# EAGLE schematic n64adv2 (EAGLE 9.1.3)

## Sheet 1 of 3
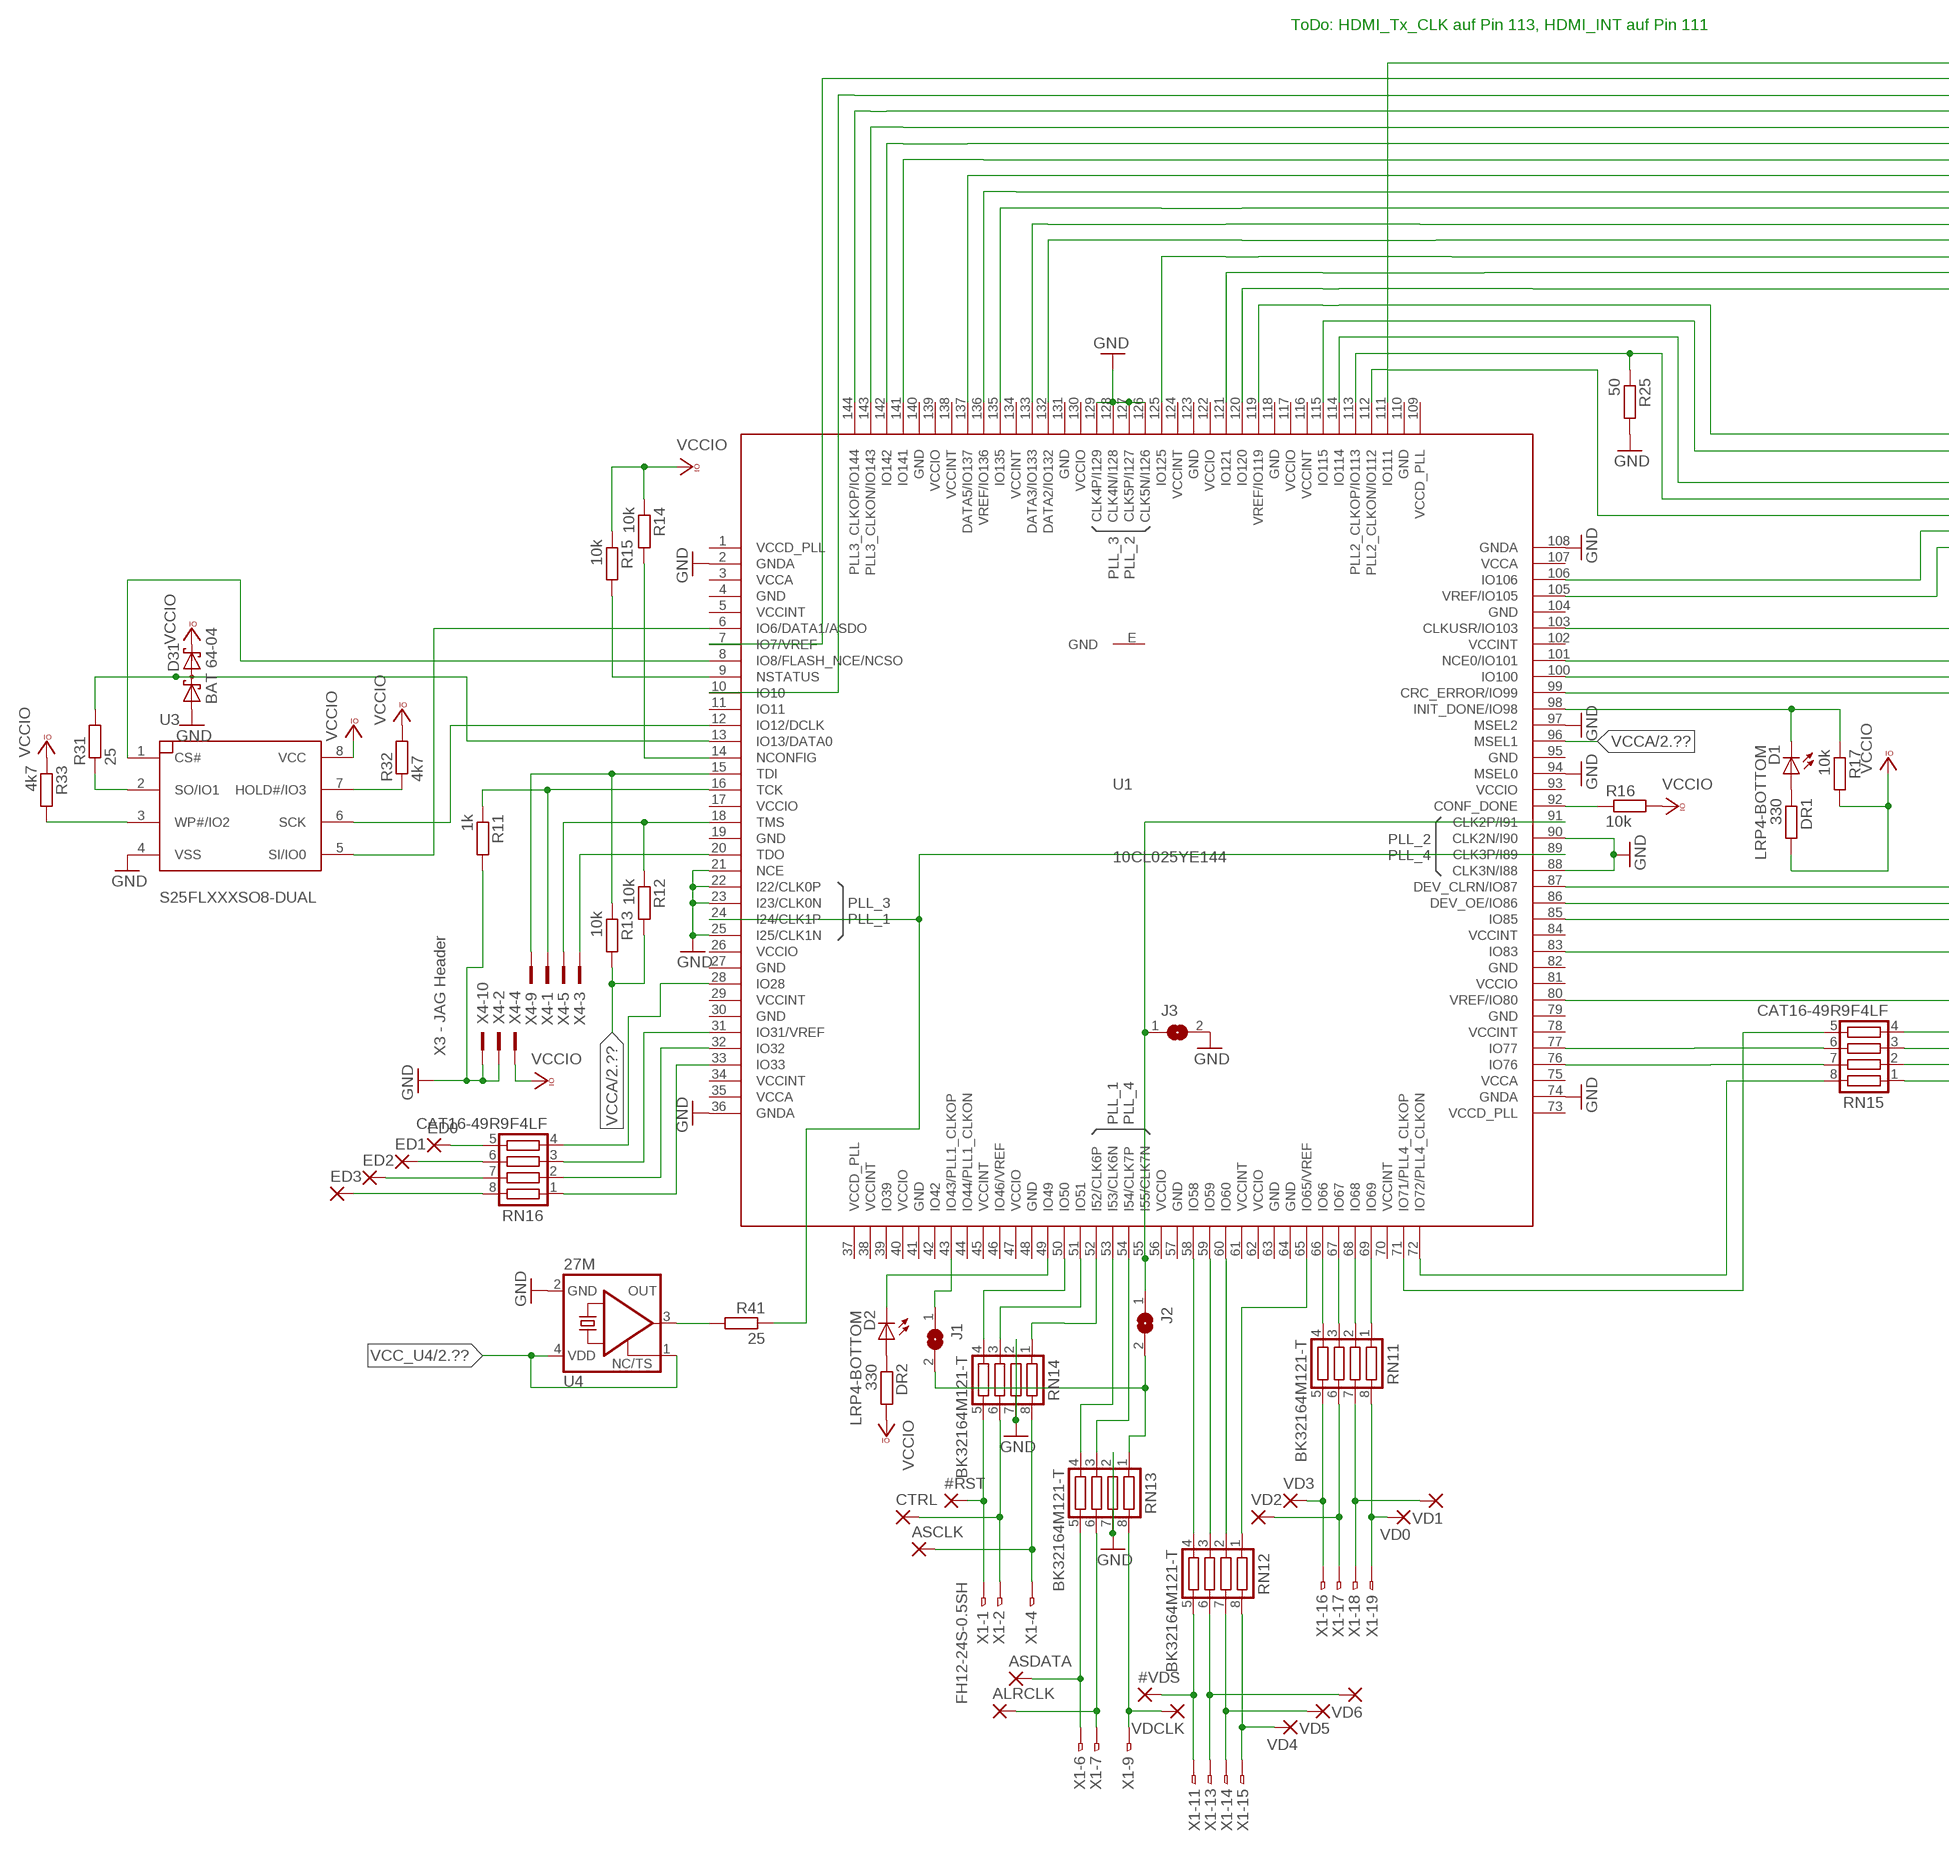
[diagram p0: schematic, sheet 1, part 1 of 2]
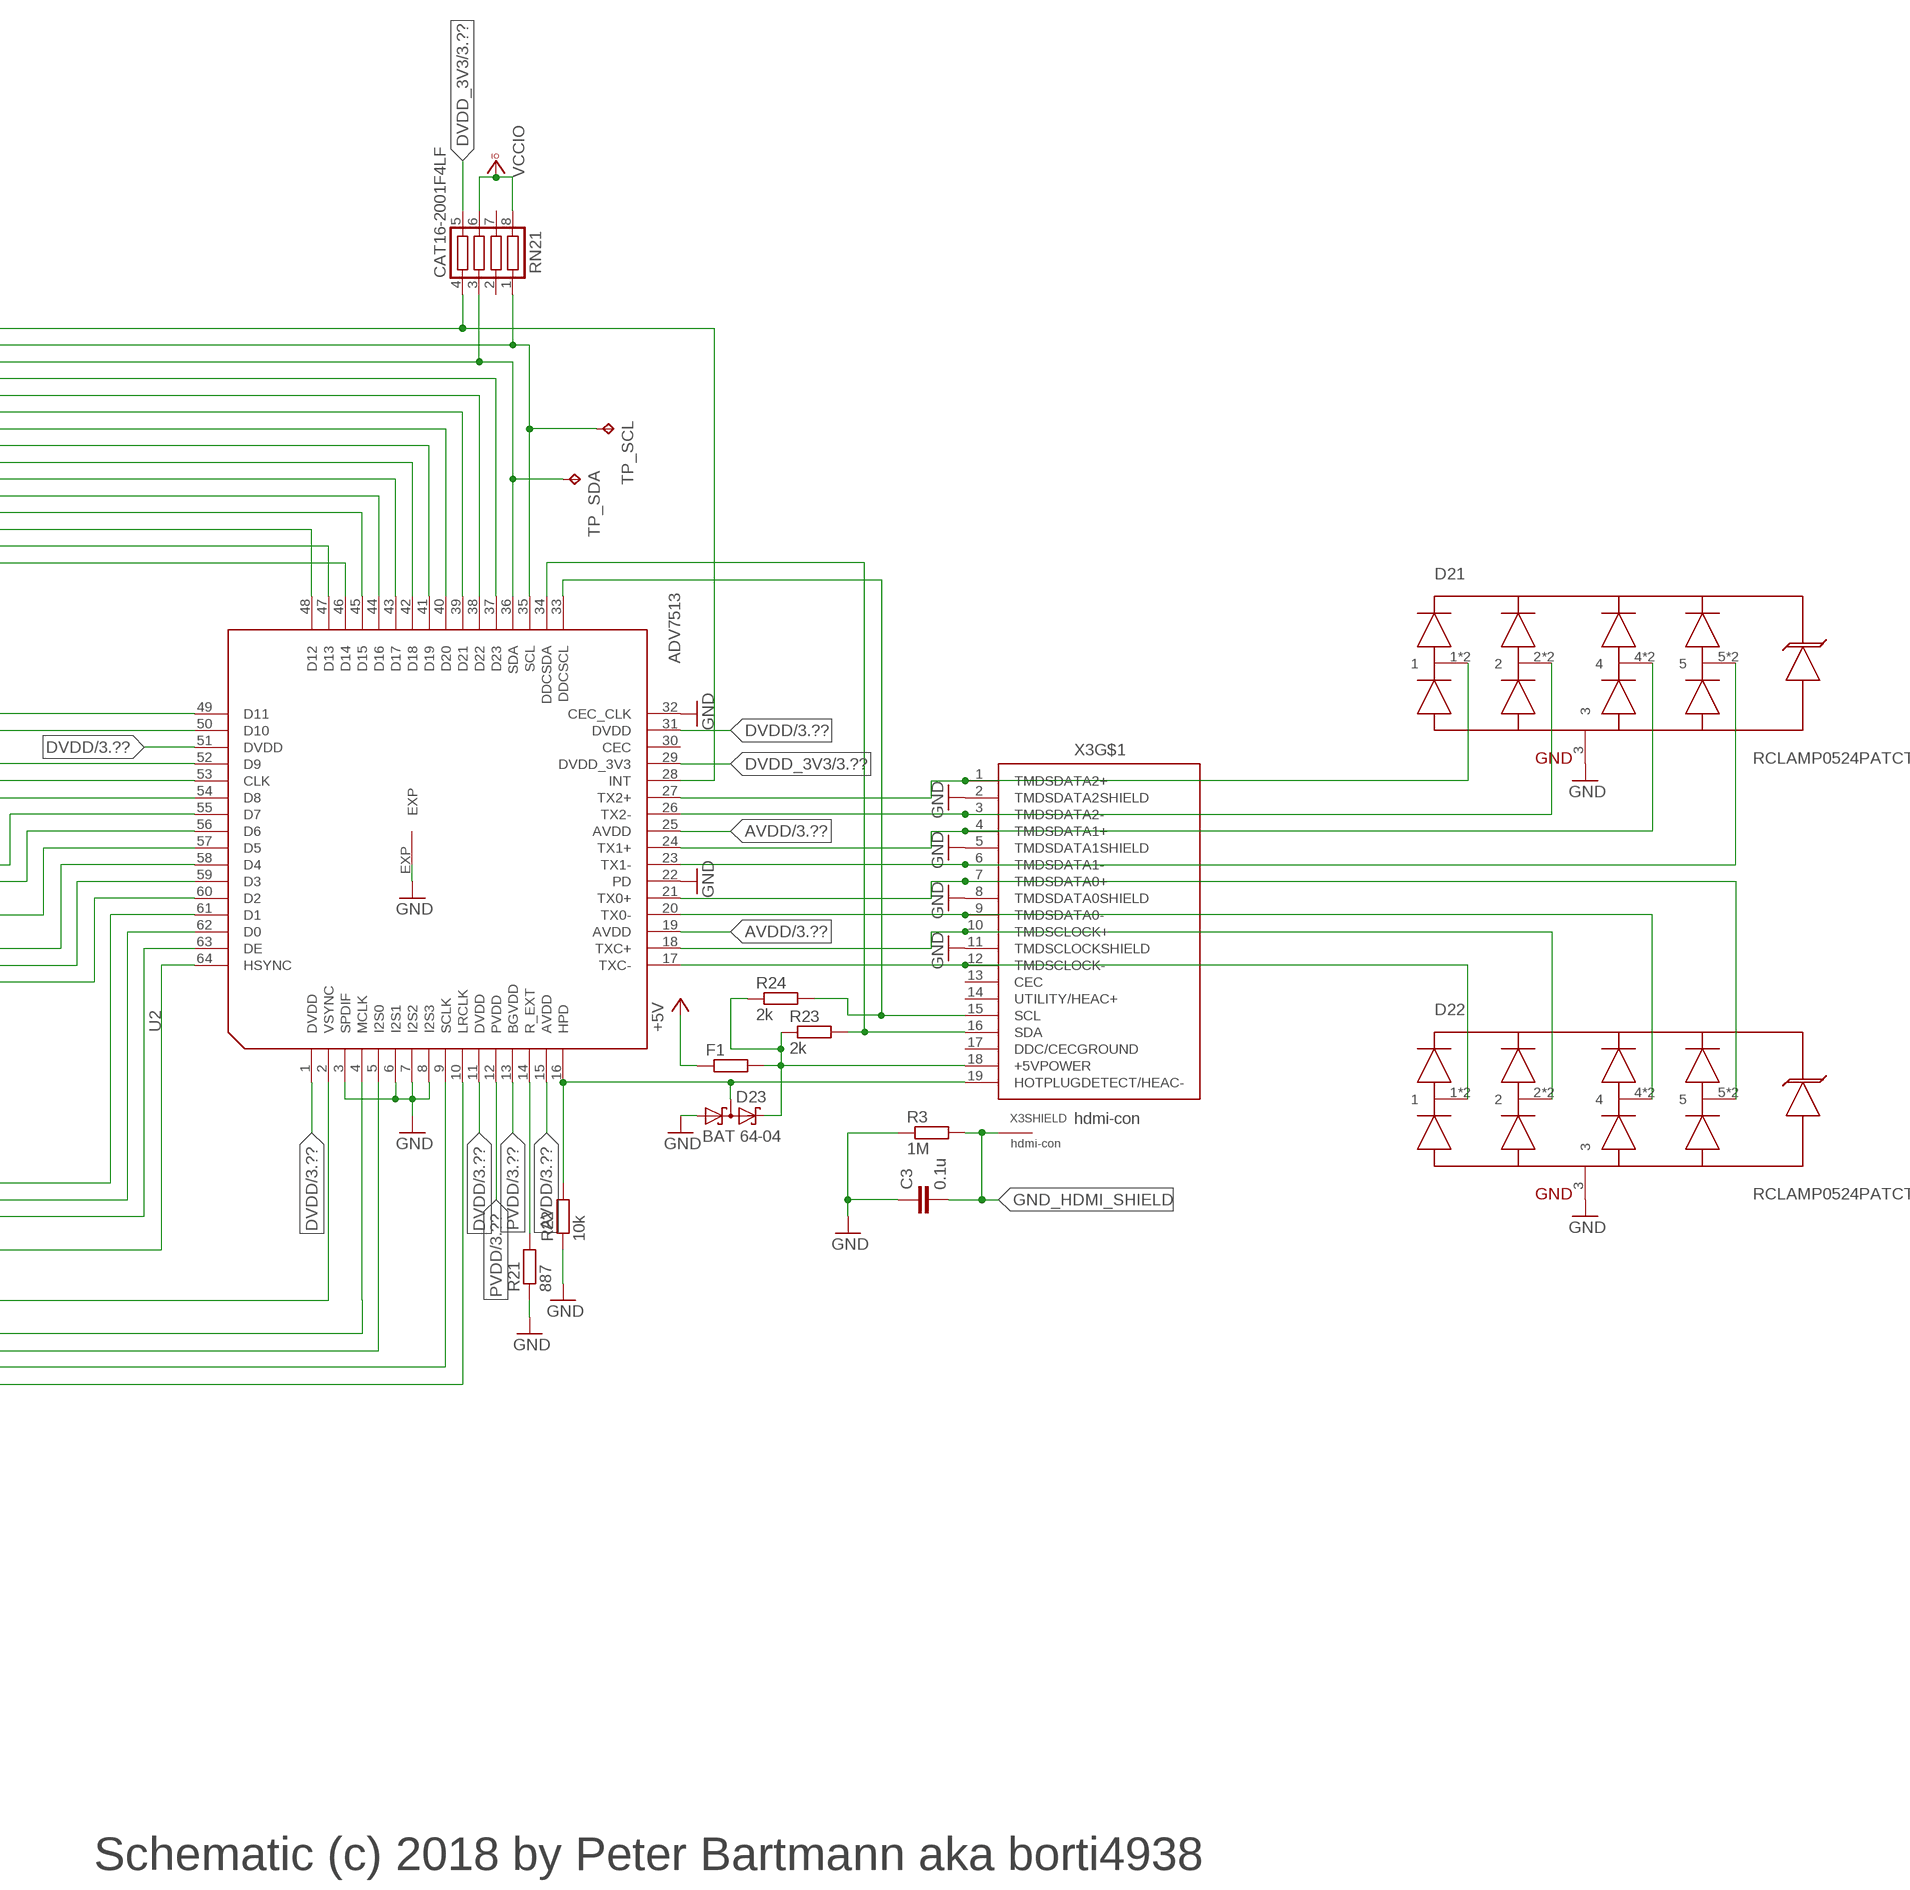
[diagram p1: schematic, sheet 1, part 2 of 2]

### Parts
#RST  SMD1  [SMD0,8-1,6]
#VDS  SMD1  [SMD0,8-1,6]
ALRCLK  SMD1  [SMD0,8-1,6]
ASCLK  SMD1  [SMD0,8-1,6]
ASDATA  SMD1  [SMD0,8-1,6]
C3  0.1u  C-EUC0603  [C0603]
CTRL  SMD1  [SMD0,8-1,6]
D1  LRP4-BOTTOM  [P47F-BOTTOM]
D2  LRP4-BOTTOM  [P47F-BOTTOM]
D21  RCLAMP0524PATCT  HDMI_RCLAMP  [HDMI_RCLAMP]
D22  RCLAMP0524PATCT  HDMI_RCLAMP  [HDMI_RCLAMP]
D23  BAT 64-04  BAT54S  [SOT23]
D31  BAT 64-04  BAT54S  [SOT23]
DR1  330  R-EU_R0603  [R0603]
DR2  330  R-EU_R0603  [R0603]
ED0  SMD1  [SMD0,8-1,6]
ED1  SMD1  [SMD0,8-1,6]
ED2  SMD1  [SMD0,8-1,6]
ED3  SMD1  [SMD0,8-1,6]
F1  R-EU_R0603  [R0603]
J1  SJSMALL  [SJ_SMALL]
J2  SJSMALL  [SJ_SMALL]
J3  SJSMALL  [SJ_SMALL]
R3  1M  R-EU_R0603  [R0603]
R11  1k  R-EU_R0603  [R0603]
R12  10k  R-EU_R0603  [R0603]
R13  10k  R-EU_R0603  [R0603]
R14  10k  R-EU_R0603  [R0603]
R15  10k  R-EU_R0603  [R0603]
R16  10k  R-EU_R0603  [R0603]
R17  10k  R-EU_R0603  [R0603]
R21  887  R-EU_R0603  [R0603]
R22  10k  R-EU_R0603  [R0603]
R23  2k  R-EU_R0603  [R0603]
R24  2k  R-EU_R0603  [R0603]
R25  50  R-EU_R0603  [R0603]
R31  25  R-EU_R0603  [R0603]
R32  4k7  R-EU_R0603  [R0603]
R33  4k7  R-EU_R0603  [R0603]
R41  25  R-EU_R0603  [R0603]
RN11  BK32164M121-T  CTS742C083  [CTS742C083]
RN12  BK32164M121-T  CTS742C083  [CTS742C083]
RN13  BK32164M121-T  CTS742C083  [CTS742C083]
RN14  BK32164M121-T  CTS742C083  [CTS742C083]
RN15  CAT16-49R9F4LF  CTS742C083  [CTS742C083]
RN16  CAT16-49R9F4LF  CTS742C083  [CTS742C083]
RN21  CAT16-2001F4LF  CTS742C083  [CTS742C083]
TP_SCL  TPB1,27  [B1,27]
TP_SDA  TPB1,27  [B1,27]
U1  10CL025YE144  [EQFP144_2]
U2  ADV7513  [LQFP64_EP]
U3  S25FLXXXSO8-DUAL  [SO8-DUAL]
U4  27M  KXO-PXO/XO-V96  [3.2X2.5_KXO-V96]
VD0  SMD1  [SMD0,8-1,6]
VD1  SMD1  [SMD0,8-1,6]
VD2  SMD1  [SMD0,8-1,6]
VD3  SMD1  [SMD0,8-1,6]
VD4  SMD1  [SMD0,8-1,6]
VD5  SMD1  [SMD0,8-1,6]
VD6  SMD1  [SMD0,8-1,6]
VDCLK  SMD1  [SMD0,8-1,6]
X1  FH12-24S-0.5SH  [FH12-24S-0.5SH]
X3  hdmi-con  685119134923  [685119134923]
X4  2510-  [PAK100/2500-10]

### Nets
+5V: F1.1 ; also sheet 3
AVDD: U2.15(AVDD) U2.19(AVDD) U2.25(AVDD) ; also sheet 3
DVDD: U2.1(DVDD) U2.11(DVDD) U2.31(DVDD) U2.51(DVDD) ; also sheet 3
DVDD_3V3: RN21.5 U2.29(DVDD_3V3) ; also sheet 3
GND: C3.1 D21.3 D22.3 D23.1(A1) D31.1(A1) J3.2 R3.1 R11.2 R21.1 R22.1 R25.2 RN13.2 RN13.7 RN14.2 RN14.7 U1.2(GNDA) U1.21(NCE) U1.22(I22/CLK0P) U1.23(I23/CLK0N) U1.25(I25/CLK1N) U1.36(GNDA) U1.74(GNDA) U1.88(CLK3N/I88) U1.90(CLK2N/I90) U1.94(MSEL0) U1.97(MSEL2) U1.108(GNDA) U1.126(CLK5N/I126) U1.127(CLK5P/I127) U1.128(CLK4N/I128) U1.129(CLK4P/I129) U2.3(SPDIF) U2.6(I2S1) U2.7(I2S2) U2.8(I2S3) U2.22(PD) U2.32(CEC_CLK) U2.EXP U3.4(VSS) U4.2(GND) X3.2(TMDSDATA2SHIELD) X3.5(TMDSDATA1SHIELD) X3.8(TMDSDATA0SHIELD) X3.11(TMDSCLOCKSHIELD) X4.2 X4.10 ; also sheet 2,3
GND_HDMI_SHIELD: C3.2 R3.2 X3.SHELL1(SHIELD:SHIELD) X3.SHELL2(SHIELD:SHIELD) X3.SHELL3(SHIELD:SHIELD) X3.SHELL(SHIELD:SHIELD)
N$1: D1.A DR1.1
N$2: RN16.1 U1.33(IO33)
N$3: RN16.2 U1.32(IO32)
N$4: RN16.3 U1.31(IO31/VREF)
N$5: RN16.4 U1.28(IO28)
N$6: ED0.P$1(P) RN16.5
N$7: ED1.P$1(P) RN16.6
N$8: ED2.P$1(P) RN16.7
N$9: J1.1 U1.43(IO43/PLL1_CLKOP)
N$10: ED3.P$1(P) RN16.8
N$11: RN15.5 U1.71(IO71/PLL4_CLKOP)
N$12: RN15.6 U1.77(IO77)
N$13: D2.C U1.49(IO49)
N$14: J1.2 J2.2 RN13.1
N$26: U1.85(IO85) U2.63(DE)
N$27: U1.83(IO83) U2.64(HSYNC)
N$28: U1.80(VREF/IO80) U2.2(VSYNC)
N$29: RN15.4 U2.4(MCLK)
N$30: RN15.3 U2.5(I2S0)
N$31: RN15.2 U2.9(SCLK)
N$32: RN15.1 U2.10(LRCLK)
N$33: D23.3(C1A2) R22.2 U2.16(HPD) X3.19(HOTPLUGDETECT/HEAC-)
N$34: D22.1 D22.10 U2.17(TXC-) X3.12(TMDSCLOCK-)
N$35: D22.2 D22.9 U2.18(TXC+) X3.10(TMDSCLOCK+)
N$36: D22.4 D22.7 U2.20(TX0-) X3.9(TMDSDATA0-)
N$37: D22.5 D22.6 U2.21(TX0+) X3.7(TMDSDATA0+)
N$38: D21.5 D21.6 U2.23(TX1-) X3.6(TMDSDATA1-)
N$39: D21.4 D21.7 U2.24(TX1+) X3.4(TMDSDATA1+)
N$40: D21.2 D21.9 U2.26(TX2-) X3.3(TMDSDATA2-)
N$41: D21.1 D21.10 U2.27(TX2+) X3.1(TMDSDATA2+)
N$42: J2.1 J3.1 U1.55(I55/CLK7N) U1.91(CLK2P/I91)
N$43: R24.2 U2.33(DDCSCL) X3.15(SCL)
N$44: R23.2 U2.34(DDCSDA) X3.16(SDA)
N$45: R21.2 U2.14(R_EXT)
N$46: RN21.4 U1.111(IO111) U2.28(INT)
N$49: RN11.1 U1.69(IO69)
N$50: R31.1 U3.2(SO/IO1)
N$51: RN15.7 U1.76(IO76)
N$52: R41.2 U4.3(OUT)
N$54: D23.2(C2) F1.2 R23.1 R24.1 X3.18(+5VPOWER)
N$56: RN15.8 U1.72(IO72/PLL4_CLKON)
N$57: RN11.5 VD3.P$1(P) X1.16
N$58: RN11.6 VD2.P$1(P) X1.17
N$59: RN11.7 VD1.P$1(P) X1.18
N$60: RN11.8 VD0.P$1(P) X1.19
N$61: R41.1 U1.24(I24/CLK1P) U1.89(CLK3P/I89)
N$62: D1.C R17.1 U1.98(INIT_DONE/IO98)
N$64: RN11.2 U1.68(IO68)
N$65: RN12.1 U1.65(IO65/VREF)
N$66: RN12.2 U1.60(IO60)
N$67: RN12.3 U1.59(IO59)
N$68: RN12.4 U1.58(IO58)
N$69: RN12.8 VD4.P$1(P) X1.15
N$70: RN12.7 VD5.P$1(P) X1.14
N$71: RN12.6 VD6.P$1(P) X1.13
N$72: #VDS.P$1(P) RN12.5 X1.11
N$73: RN13.8 VDCLK.P$1(P) X1.9
N$74: ALRCLK.P$1(P) RN13.6 X1.7
N$75: ASDATA.P$1(P) RN13.5 X1.6
N$76: RN14.1 U1.52(I52/CLK6P)
N$77: RN13.3 U1.54(I54/CLK7P)
N$78: RN13.4 U1.53(I53/CLK6N)
N$79: ASCLK.P$1(P) RN14.8 X1.4
N$80: CTRL.P$1(P) RN14.6 X1.2
N$81: #RST.P$1(P) RN14.5 X1.1
N$82: RN14.4 U1.50(IO50)
N$83: RN14.3 U1.51(IO51)
N$84: RN11.3 U1.67(IO67)
N$85: U1.8(IO8/FLASH_NCE/NCSO) U3.1(CS#)
N$86: U1.6(IO6/DATA1/ASDO) U3.5(SI/IO0)
N$87: D31.3(C1A2) R31.2 U1.13(IO13/DATA0)
N$88: U1.12(IO12/DCLK) U3.6(SCK)
N$89: R33.2 U3.3(WP#/IO2)
N$90: R32.1 U3.7(HOLD#/IO3)
N$91: R11.1 U1.16(TCK) X4.1
N$92: U1.20(TDO) X4.3
N$93: R12.1 U1.18(TMS) X4.5
N$94: R13.1 U1.15(TDI) X4.9
N$95: RN11.4 U1.66(IO66)
N$96: R15.2 U1.9(NSTATUS)
N$97: R14.2 U1.14(NCONFIG)
N$98: R16.1 U1.92(CONF_DONE)
N$99: D2.A DR2.1
PVDD: U2.12(PVDD) U2.13(BGVDD) ; also sheet 3
SCL: RN21.1 TP_SCL.TP U1.7(IO7/VREF) U2.35(SCL)
SDA: RN21.3 TP_SDA.TP U1.10(IO10) U2.36(SDA)
TX_B0: U1.86(DEV_OE/IO86) U2.62(D0)
TX_B1: U1.87(DEV_CLRN/IO87) U2.61(D1)
TX_B2: U1.99(CRC_ERROR/IO99) U2.60(D2)
TX_B3: U1.100(IO100) U2.59(D3)
TX_B4: U1.101(NCE0/IO101) U2.58(D4)
TX_B5: U1.103(CLKUSR/IO103) U2.57(D5)
TX_B6: U1.105(VREF/IO105) U2.56(D6)
TX_B7: U1.106(IO106) U2.55(D7)
TX_CLK: R25.1 U1.113(PLL2_CLKOP/IO113) U2.53(CLK)
TX_G0: U1.112(PLL2_CLKON/IO112) U2.54(D8)
TX_G1: U1.114(IO114) U2.52(D9)
TX_G2: U1.115(IO115) U2.50(D10)
TX_G3: U1.119(VREF/IO119) U2.49(D11)
TX_G4: U1.125(IO125) U2.48(D12)
TX_G5: U1.121(IO121) U2.47(D13)
TX_G6: U1.120(IO120) U2.46(D14)
TX_G7: U1.132(DATA2/IO132) U2.45(D15)
TX_R0: U1.133(DATA3/IO133) U2.44(D16)
TX_R1: U1.135(IO135) U2.43(D17)
TX_R2: U1.136(VREF/IO136) U2.42(D18)
TX_R3: U1.137(DATA5/IO137) U2.41(D19)
TX_R4: U1.141(IO141) U2.40(D20)
TX_R5: U1.142(IO142) U2.39(D21)
TX_R6: U1.143(PLL3_CLKON/IO143) U2.38(D22)
TX_R7: U1.144(PLL3_CLKOP/IO144) U2.37(D23)
VCC_U4: U4.1(TS) U4.4(VDD) ; also sheet 2
VCCA: R12.2 R13.2 U1.96(MSEL1) ; also sheet 2
VCCIO: D31.2(C2) DR1.2 DR2.2 R14.1 R15.1 R16.2 R17.2 R32.2 R33.1 RN21.6 RN21.8 U3.8(VCC) X4.4 ; also sheet 2
Unconnected: RN21.2 RN21.7 U1.11(IO11) U1.39(IO39) U1.42(IO42) U1.44(IO44/PLL1_CLKON) U1.46(IO46/VREF) U2.30(CEC) X3.13(CEC) X3.14(UTILITY/HEAC+) X3.17(DDC/CECGROUND) X4.6 X4.7 X4.8

### Notes on the sheet
- ToDo: HDMI_Tx_CLK auf Pin 113, HDMI_INT auf Pin 111
- X3 - JAG Header
- Schematic (c) 2018 by Peter Bartmann aka borti4938

## Sheet 2 of 3
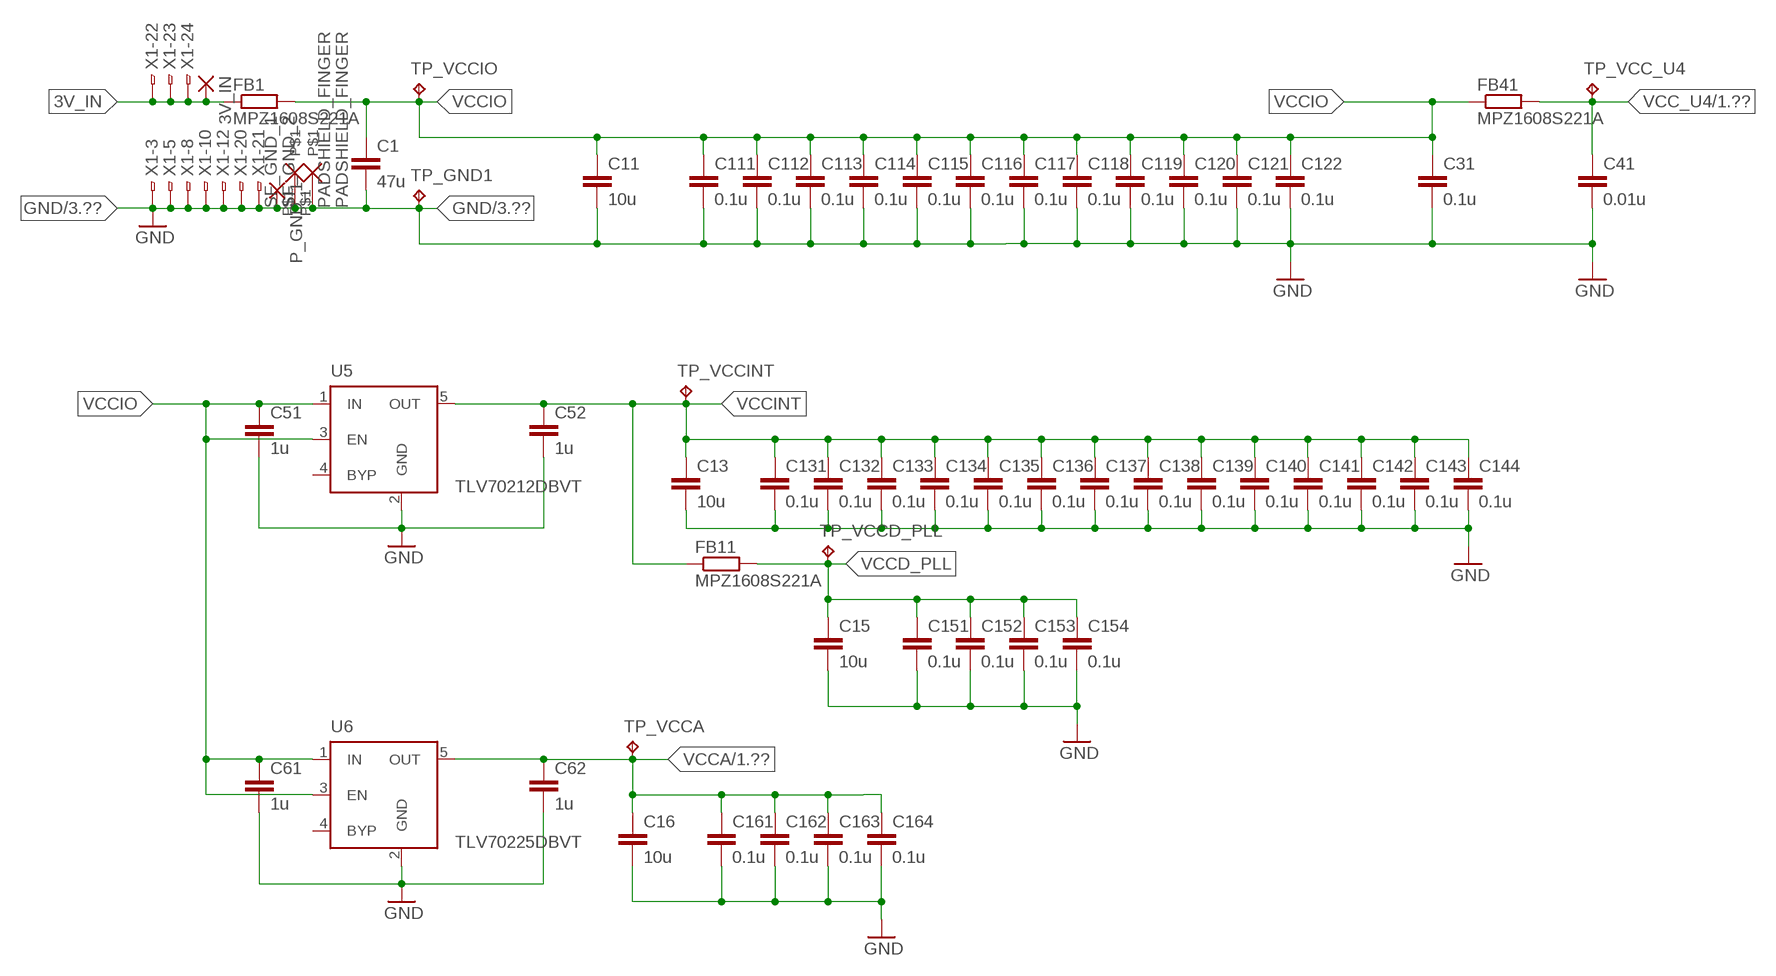
[diagram p2: schematic, sheet 2]

### Parts
3V_IN  SMD2  [SMD1,27-2,54]
C1  47u  C-EUC0805  [C0805]
C11  10u  C-EUC0805  [C0805]
C13  10u  C-EUC0805  [C0805]
C15  10u  C-EUC0805  [C0805]
C16  10u  C-EUC0805  [C0805]
C31  0.1u  C-EUC0603  [C0603]
C41  0.01u  C-EUC0603  [C0603]
C51  1u  C-EUC0603  [C0603]
C52  1u  C-EUC0603  [C0603]
C61  1u  C-EUC0603  [C0603]
C62  1u  C-EUC0603  [C0603]
C111  0.1u  C-EUC0603  [C0603]
C112  0.1u  C-EUC0603  [C0603]
C113  0.1u  C-EUC0603  [C0603]
C114  0.1u  C-EUC0603  [C0603]
C115  0.1u  C-EUC0603  [C0603]
C116  0.1u  C-EUC0603  [C0603]
C117  0.1u  C-EUC0603  [C0603]
C118  0.1u  C-EUC0603  [C0603]
C119  0.1u  C-EUC0603  [C0603]
C120  0.1u  C-EUC0603  [C0603]
C121  0.1u  C-EUC0603  [C0603]
C122  0.1u  C-EUC0603  [C0603]
C131  0.1u  C-EUC0603  [C0603]
C132  0.1u  C-EUC0603  [C0603]
C133  0.1u  C-EUC0603  [C0603]
C134  0.1u  C-EUC0603  [C0603]
C135  0.1u  C-EUC0603  [C0603]
C136  0.1u  C-EUC0603  [C0603]
C137  0.1u  C-EUC0603  [C0603]
C138  0.1u  C-EUC0603  [C0603]
C139  0.1u  C-EUC0603  [C0603]
C140  0.1u  C-EUC0603  [C0603]
C141  0.1u  C-EUC0603  [C0603]
C142  0.1u  C-EUC0603  [C0603]
C143  0.1u  C-EUC0603  [C0603]
C144  0.1u  C-EUC0603  [C0603]
C151  0.1u  C-EUC0603  [C0603]
C152  0.1u  C-EUC0603  [C0603]
C153  0.1u  C-EUC0603  [C0603]
C154  0.1u  C-EUC0603  [C0603]
C161  0.1u  C-EUC0603  [C0603]
C162  0.1u  C-EUC0603  [C0603]
C163  0.1u  C-EUC0603  [C0603]
C164  0.1u  C-EUC0603  [C0603]
FB1  MPZ1608S221A  R-EU_R0603  [R0603]
FB11  MPZ1608S221A  R-EU_R0603  [R0603]
FB41  MPZ1608S221A  R-EU_R0603  [R0603]
P_GND_1  SMD2  [SMD1,27-2,54]
SF_GND_1  PADSHIELD_FINGER  [GND_FINGER_PAD]
SF_GND_2  PADSHIELD_FINGER  [GND_FINGER_PAD]
TP_GND1  TPB1,27  [B1,27]
TP_VCC_U4  TPB1,27  [B1,27]
TP_VCCA  TPB1,27  [B1,27]
TP_VCCD_PLL  TPB1,27  [B1,27]
TP_VCCINT  TPB1,27  [B1,27]
TP_VCCIO  TPB1,27  [B1,27]
U5  TLV70212DBVT  MIC5219XX  [SOT23-5]
U6  TLV70225DBVT  MIC5219XX  [SOT23-5]

### Nets
3V_IN: 3V_IN.1(P) FB1.1 X1.22 X1.23 X1.24
GND: C1.2 C11.2 C13.2 C15.2 C16.2 C31.2 C41.2 C51.2 C52.2 C61.2 C62.2 C111.2 C112.2 C113.2 C114.2 C115.2 C116.2 C117.2 C118.2 C119.2 C120.2 C121.2 C122.2 C131.2 C132.2 C133.2 C134.2 C135.2 C136.2 C137.2 C138.2 C139.2 C140.2 C141.2 C142.2 C143.2 C144.2 C151.2 C152.2 C153.2 C154.2 C161.2 C162.2 C163.2 C164.2 P_GND_1.1(P) SF_GND_1.P$1 SF_GND_2.P$1 TP_GND1.TP U5.2(GND) U6.2(GND) X1.3 X1.5 X1.8 X1.10 X1.12 X1.20 X1.21 ; also sheet 1,3
VCC_U4: C41.1 FB41.2 TP_VCC_U4.TP ; also sheet 1
VCCA: C16.1 C62.1 C161.1 C162.1 C163.1 C164.1 TP_VCCA.TP U6.5(OUT) ; also sheet 1
VCCD_PLL: C15.1 C151.1 C152.1 C153.1 C154.1 FB11.2 TP_VCCD_PLL.TP
VCCINT: C13.1 C52.1 C131.1 C132.1 C133.1 C134.1 C135.1 C136.1 C137.1 C138.1 C139.1 C140.1 C141.1 C142.1 C143.1 C144.1 FB11.1 TP_VCCINT.TP U5.5(OUT)
VCCIO: C1.1 C11.1 C31.1 C51.1 C61.1 C111.1 C112.1 C113.1 C114.1 C115.1 C116.1 C117.1 C118.1 C119.1 C120.1 C121.1 C122.1 FB1.2 FB41.1 TP_VCCIO.TP U5.1(IN) U5.3(EN) U6.1(IN) U6.3(EN) ; also sheet 1
Unconnected: U5.4(BYP) U6.4(BYP)

## Sheet 3 of 3
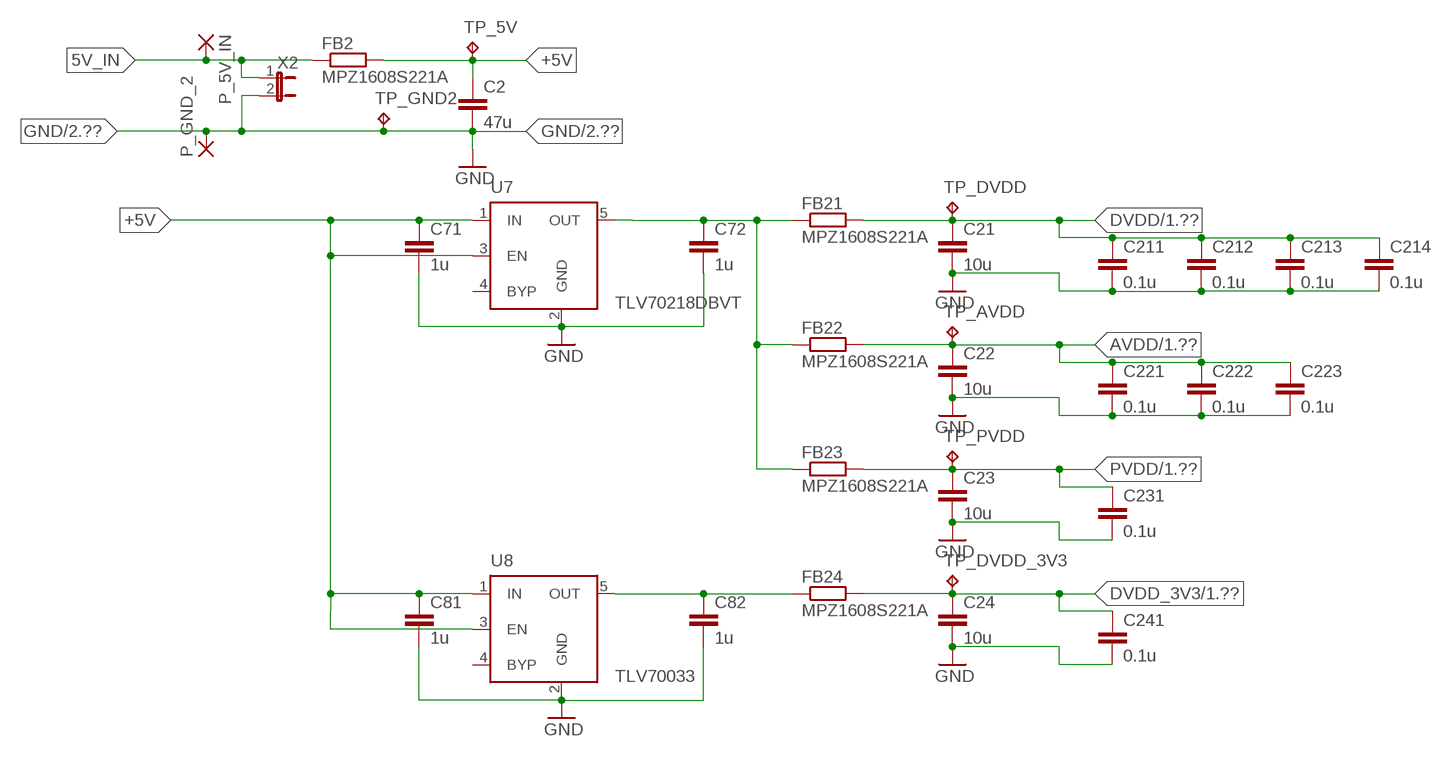
[diagram p3: schematic, sheet 3]

### Parts
C2  47u  C-EUC0805  [C0805]
C21  10u  C-EUC0805  [C0805]
C22  10u  C-EUC0805  [C0805]
C23  10u  C-EUC0805  [C0805]
C24  10u  C-EUC0805  [C0805]
C71  1u  C-EUC0603  [C0603]
C72  1u  C-EUC0603  [C0603]
C81  1u  C-EUC0603  [C0603]
C82  1u  C-EUC0603  [C0603]
C211  0.1u  C-EUC0603  [C0603]
C212  0.1u  C-EUC0603  [C0603]
C213  0.1u  C-EUC0603  [C0603]
C214  0.1u  C-EUC0603  [C0603]
C221  0.1u  C-EUC0603  [C0603]
C222  0.1u  C-EUC0603  [C0603]
C223  0.1u  C-EUC0603  [C0603]
C231  0.1u  C-EUC0603  [C0603]
C241  0.1u  C-EUC0603  [C0603]
FB2  MPZ1608S221A  R-EU_R0603  [R0603]
FB21  MPZ1608S221A  R-EU_R0603  [R0603]
FB22  MPZ1608S221A  R-EU_R0603  [R0603]
FB23  MPZ1608S221A  R-EU_R0603  [R0603]
FB24  MPZ1608S221A  R-EU_R0603  [R0603]
P_5V_IN  SMD2  [SMD1,27-2,54]
P_GND_2  SMD2  [SMD1,27-2,54]
TP_5V  TPB1,27  [B1,27]
TP_AVDD  TPB1,27  [B1,27]
TP_DVDD  TPB1,27  [B1,27]
TP_DVDD_3V3  TPB1,27  [B1,27]
TP_GND2  TPB1,27  [B1,27]
TP_PVDD  TPB1,27  [B1,27]
U7  TLV70218DBVT  MIC5219XX  [SOT23-5]
U8  TLV70033  MIC5219XX  [SOT23-5]
X2  JP1E  [JP1]

### Nets
1.8V_PRE: C72.1 FB21.1 FB22.1 FB23.1 U7.5(OUT)
3.3V_PRE: C82.1 FB24.1 U8.5(OUT)
5V_IN: FB2.1 P_5V_IN.1(P) X2.1
+5V: C2.1 C71.1 C81.1 FB2.2 TP_5V.TP U7.1(IN) U7.3(EN) U8.1(IN) U8.3(EN) ; also sheet 1
AVDD: C22.1 C221.1 C222.1 C223.1 FB22.2 TP_AVDD.TP ; also sheet 1
DVDD: C21.1 C211.1 C212.1 C213.1 C214.1 FB21.2 TP_DVDD.TP ; also sheet 1
DVDD_3V3: C24.1 C241.1 FB24.2 TP_DVDD_3V3.TP ; also sheet 1
GND: C2.2 C21.2 C22.2 C23.2 C24.2 C71.2 C72.2 C81.2 C82.2 C211.2 C212.2 C213.2 C214.2 C221.2 C222.2 C223.2 C231.2 C241.2 P_GND_2.1(P) TP_GND2.TP U7.2(GND) U8.2(GND) X2.2 ; also sheet 1,2
PVDD: C23.1 C231.1 FB23.2 TP_PVDD.TP ; also sheet 1
Unconnected: U7.4(BYP) U8.4(BYP)

## Power pins joined to a net without a drawn wire
GND: U1.4(GND) U1.19(GND) U1.27(GND) U1.30(GND) U1.41(GND) U1.48(GND) U1.57(GND) U1.63(GND) U1.64(GND) U1.79(GND) U1.82(GND) U1.95(GND) U1.104(GND) U1.110(GND) U1.118(GND) U1.123(GND) U1.131(GND) U1.140(GND) U1.E(GND)
VCCA: U1.3(VCCA) U1.35(VCCA) U1.75(VCCA) U1.107(VCCA)
VCCD_PLL: U1.1(VCCD_PLL) U1.37(VCCD_PLL) U1.73(VCCD_PLL) U1.109(VCCD_PLL)
VCCINT: U1.5(VCCINT) U1.29(VCCINT) U1.34(VCCINT) U1.38(VCCINT) U1.45(VCCINT) U1.61(VCCINT) U1.70(VCCINT) U1.78(VCCINT) U1.84(VCCINT) U1.102(VCCINT) U1.116(VCCINT) U1.124(VCCINT) U1.134(VCCINT) U1.138(VCCINT)
VCCIO: U1.17(VCCIO) U1.26(VCCIO) U1.40(VCCIO) U1.47(VCCIO) U1.56(VCCIO) U1.62(VCCIO) U1.81(VCCIO) U1.93(VCCIO) U1.117(VCCIO) U1.122(VCCIO) U1.130(VCCIO) U1.139(VCCIO)

## Library data of the parts
3V_IN P_5V_IN P_GND_1 P_GND_2 = wirepad:SMD2: SMD PAD
#RST #VDS ALRCLK ASCLK ASDATA CTRL ED0 ED1-ED3 VD0 VD1-VD6 VDCLK = wirepad:SMD1
C1-C3 C11 C13 C15 C16 C21-C24 C31 C41 C51 C52 C61 C62 C71 C72 C81 C82 C111-C122 C131-C144 C151-C154 C161-C164 C211-C214 C221-C223 C231 C241 = rcl:C-EU: CAPACITOR, European symbol
D1 D2 = led:*P4: PointLED® Enhanced Thinfilm LED TOP & BOTTOM mount
D21 D22 = snes_div:HDMI_RCLAMP
D23 D31 = diode:BAT54S: Schottky Diodes Pin connection corrected 2011-05-04 Source: Fairchild .. BAT54.pdf
DR1 DR2 F1 FB1 FB2 FB11 FB21-FB24 FB41 R3 R11-R17 R21-R25 R31-R33 R41 = rcl:R-EU_: RESISTOR, European symbol
J1-J3 = jumper:SJ: SMD solder JUMPER
RN11-RN16 RN21 = resistor-net:CTS742C083: Chip Resistor Array 4 Single Resistor Source: http://www.ctscorp.com/components/Datasheets/CTSChipArrayDs.pdf; OC_FARNELL: unknown; OC_NEWARK: unknown
SF_GND_1 SF_GND_2 = snes_div:PAD
TP_5V TP_AVDD TP_DVDD TP_DVDD_3V3 TP_GND1 TP_GND2 TP_PVDD TP_SCL TP_SDA TP_VCC_U4 TP_VCCA TP_VCCD_PLL TP_VCCINT TP_VCCIO = testpad:TP: Test pad
U1 = altera:10CL025YE144
U2 = analog-devices:ADV7513
U3 = cypress:S25FLXXX
U4 = crystal-geyer_V1_0:KXO-PXO/XO-V: Clock Oscillator (PXO/XO) MHz : KXO-V - Serie Model Size l/w/h [mm] Frequency Range Frequency Stability Temp. Range [°C] Output AECQ 200 availabel Datasheet KXO-V94 KXO-V94 KXO-V95 KXO-V95 KXO-V96 KXO-V96 KXO-V99 KXO-V99 KXO-97 KXO-V97 KXO-97 - KXO-V97 2.0/1.6/0.80 2.0/1.6/0.80 2.5/2.0/0.82 ...
U5-U8 = v-reg-micrel:MIC5219XX: VOLTAGE REGULATOR; OC_FARNELL: unknown; OC_NEWARK: unknown
X1 = con-hirose:FH12-24S-0.5S: 0.5mm Pitch Connectors For FPC/FFC Source: Data sheet <http://www.hirose.co.jp/cataloge_hp/e58605370.pdf>; MPN: FH12-24S-0.5SH(55); OC_FARNELL: 1324552; OC_NEWARK: 34M6170
X2 = jumper:JP1E: JUMPER
X3 = WE_IO_rev18a:685119134923: WR-COM SMT Horizontal HDMI, 19 pins=>Code : Con_I-O_COM_HDMI_685119134923 <http://katalog.we-online.de/media/images/eican/Con_I-O_COM_HDMI_685119134923_pf2.jpg> Details see: http://katalog.we-online.de/en/em/COM_SMT_HORIZONTAL/685119134923 Created 2014-07-09, Karrer Zheng 2014 (C) Würth Elektronik
X4 = con-3m:2510-: 3M (TM) Pak 100 4-Wall Header Source: 3M; MF: 3M; MPN: 2510-6002UB; OC_FARNELL: 9838244; OC_NEWARK: 46F4725